# Altium schematic sheet Voltage_Protection.SchDoc
size 381 x 241 mm; SheetNumber: 4; SheetTotal: 6
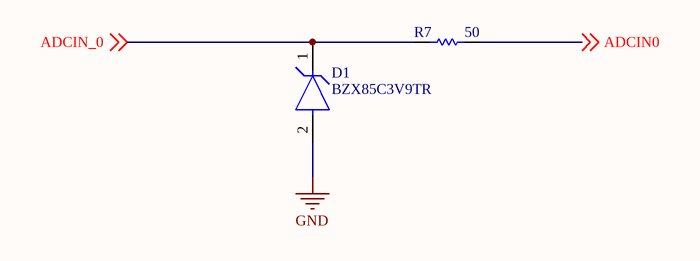
[diagram p0: Voltage_Protection.SchDoc]

## Parts
D1  BZX85C3V9TR  [FP-017AH-MFG]
R7  value 50  (hidden comment: Resistor)

## Nets
GND: D1.2(A)
ADCIN0: R7.2 ; off-sheet ADCIN0
ADCIN_0: D1.1(C) R7.1 ; off-sheet ADCIN_0

## Library data of the parts
D1 = CMP-00278-00328084-1: BZX85C3V9TR Tape & Reel (TR) ±5% Through Hole Single Zener Diode 1.2V @ 200mA 5muA @ 1V 1W 3.9V; NexarPartId: 328084; Zener Current: 60mA; Impedance: 15Ω; Max Reverse Leakage Current: 5µA; Packaging: Tape & Reel; Power Dissipation: 1W; Test Current: 60mA; Tolerance: 5%; Lead Free: Lead Free; Zener Voltage: 3.9V; Voltage Tolerance: 5%; Power Rating: 1W; Number of Pins: 2; Mount: Through Hole; Radiation Hardening: No; Min Operating Temperature: -65°C; Element Configuration: Single; Max Operating Temperature: 200°C; RoHS: Compliant; Voltage Rating (DC): 3.9V; Max Power Dissipation: 1W
R7 = Resistor: TC1: 0; SimulationGenericComponent: True; TC2: 0